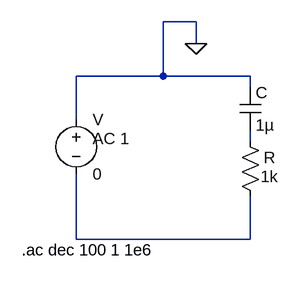
[diagram p0: schematic RC-Series.asc]
RC-Series.asc, the LTspice schematic file:
Version 4.1
SHEET 1 880 680
WIRE -112 -464 -160 -464
WIRE -112 -432 -112 -464
WIRE -160 -384 -160 -464
WIRE -160 -384 -288 -384
WIRE -32 -384 -160 -384
WIRE -32 -368 -32 -384
WIRE -288 -320 -288 -384
WIRE -32 -288 -32 -304
WIRE -288 -144 -288 -240
WIRE -32 -144 -32 -208
WIRE -32 -144 -288 -144
FLAG -112 -432 0
SYMBOL res -48 -304 R0
WINDOW 0 44 40 Center 2
WINDOW 3 44 68 Center 2
SYMATTR InstName R
SYMATTR Value 1k
SYMBOL voltage -288 -336 R0
WINDOW 123 24 44 Left 2
WINDOW 39 0 0 Left 0
SYMATTR Value2 AC 1
SYMATTR InstName V
SYMATTR Value 0
SYMBOL cap -48 -368 R0
SYMATTR InstName C
SYMATTR Value 1µ
TEXT -368 -128 Left 2 !.ac dec 100 1 1e6

The netlist it stands for:
* RC-Series.asc
R N001 N002 1k
V 0 N002 0 AC 1
C 0 N001 1µ
.ac dec 100 1 1e6
.backanno
.end